# Altium schematic sheet Power_Selection_Archived.SchDoc
size A4
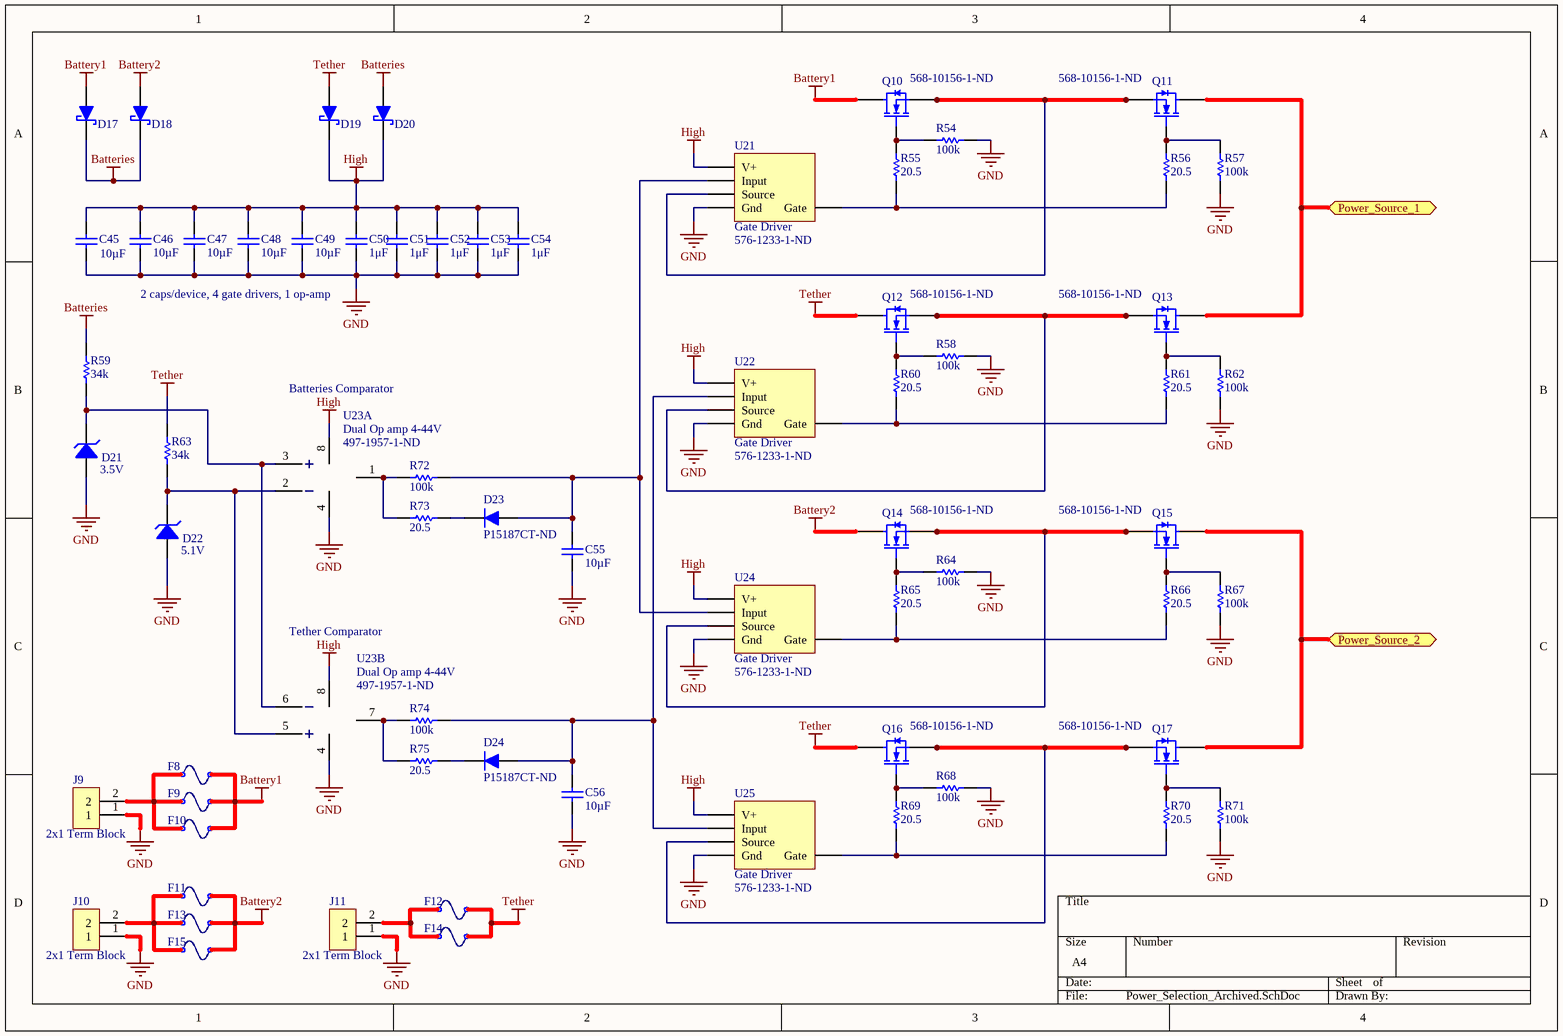
[diagram p0: Power_Selection_Archived.SchDoc]

## Parts
C45  10µF  [CAPC3216N(1206")]
C46  10µF  [CAPC3216N(1206")]
C47  10µF  [CAPC3216N(1206")]
C48  10µF  [CAPC3216N(1206")]
C49  10µF  [CAPC3216N(1206")]
C50  1μF  [CAPC1608N(0603")]
C51  1μF  [CAPC1608N(0603")]
C52  1μF  [CAPC1608N(0603")]
C53  1μF  [CAPC1608N(0603")]
C54  1μF  [CAPC1608N(0603")]
C55  10µF  [CAPC3216N(1206")]
C56  10µF  [CAPC3216N(1206")]
D17  CUS08F30H3FCT-ND  [SC-76]  (value not drawn)
D18  CUS08F30H3FCT-ND  [SC-76]  (value not drawn)
D19  CUS08F30H3FCT-ND  [SC-76]  (value not drawn)
D20  CUS08F30H3FCT-ND  [SC-76]  (value not drawn)
D21  Voltage - Breakdown (Min): 3.5V  [SODFL160X70-2N]  (hidden comment: UCLAMP3301H.TCT)
D22  Voltage - Zener (Nom) (Vz): 5.1V  (hidden comment: MM3Z5V1ST1G)
D23  Supplier Part Number 1: P15187CT-ND  [SODFL535X110-2N]  (hidden comment: DA2S10400L, SOD323F / SC-90)  (no BOM)
D24  Supplier Part Number 1: P15187CT-ND  [SODFL535X110-2N]  (hidden comment: DA2S10400L, SOD323F / SC-90)  (no BOM)
F8  MINI  [MINI BLADE FUSEHOLDER]  (value not drawn)
F9  MINI  [MINI BLADE FUSEHOLDER]  (value not drawn)
F10  MINI  [MINI BLADE FUSEHOLDER]  (value not drawn)
F11  MINI  [MINI BLADE FUSEHOLDER]  (value not drawn)
F12  MINI  [MINI BLADE FUSEHOLDER]  (value not drawn)
F13  MINI  [MINI BLADE FUSEHOLDER]  (value not drawn)
F14  MINI  [MINI BLADE FUSEHOLDER]  (value not drawn)
F15  MINI  [MINI BLADE FUSEHOLDER]  (value not drawn)
J9  2x1 Term Block  [2x1 Terminal Blocks EM2929]
J10  2x1 Term Block  [2x1 Terminal Blocks EM2929]
J11  2x1 Term Block  [2x1 Terminal Blocks EM2929]
Q10  Supplier Part Number 1: 568-10156-1-ND  [LFPAK-PowerSO8]  (hidden comment: MOSFET N-Channel, 40V, 100A, 272W)
Q11  Supplier Part Number 1: 568-10156-1-ND  [LFPAK-PowerSO8]  (hidden comment: MOSFET N-Channel, 40V, 100A, 272W)
Q12  Supplier Part Number 1: 568-10156-1-ND  [LFPAK-PowerSO8]  (hidden comment: MOSFET N-Channel, 40V, 100A, 272W)
Q13  Supplier Part Number 1: 568-10156-1-ND  [LFPAK-PowerSO8]  (hidden comment: MOSFET N-Channel, 40V, 100A, 272W)
Q14  Supplier Part Number 1: 568-10156-1-ND  [LFPAK-PowerSO8]  (hidden comment: MOSFET N-Channel, 40V, 100A, 272W)
Q15  Supplier Part Number 1: 568-10156-1-ND  [LFPAK-PowerSO8]  (hidden comment: MOSFET N-Channel, 40V, 100A, 272W)
Q16  Supplier Part Number 1: 568-10156-1-ND  [LFPAK-PowerSO8]  (hidden comment: MOSFET N-Channel, 40V, 100A, 272W)
Q17  Supplier Part Number 1: 568-10156-1-ND  [LFPAK-PowerSO8]  (hidden comment: MOSFET N-Channel, 40V, 100A, 272W)
R54  100k  [RESC2012N(0805")]
R55  20.5  [RESC1608N(0603")]
R56  20.5  [RESC1608N(0603")]
R57  100k  [RESC2012N(0805")]
R58  100k  [RESC2012N(0805")]
R59  34k  [RESC1608N(0603")]
R60  20.5  [RESC1608N(0603")]
R61  20.5  [RESC1608N(0603")]
R62  100k  [RESC2012N(0805")]
R63  34k  [RESC1608N(0603")]
R64  100k  [RESC2012N(0805")]
R65  20.5  [RESC1608N(0603")]
R66  20.5  [RESC1608N(0603")]
R67  100k  [RESC2012N(0805")]
R68  100k  [RESC2012N(0805")]
R69  20.5  [RESC1608N(0603")]
R70  20.5  [RESC1608N(0603")]
R71  100k  [RESC2012N(0805")]
R72  100k  [RESC2012N(0805")]
R73  20.5  [RESC1608N(0603")]
R74  100k  [RESC2012N(0805")]
R75  20.5  [RESC1608N(0603")]
U21  Gate Driver  Supplier Part Number 1: 576-1233-1-ND  [SOC 8]
U22  Gate Driver  Supplier Part Number 1: 576-1233-1-ND  [SOC 8]
U23  Dual Op amp 4-44V  Supplier Part Number 2: 497-1957-1-ND  [SOC-8]  (parts A,B of 2)
U24  Gate Driver  Supplier Part Number 1: 576-1233-1-ND  [SOC 8]
U25  Gate Driver  Supplier Part Number 1: 576-1233-1-ND  [SOC 8]

## Ports
Power_Source_1, Power_Source_2

## Nets
Batteries: D17.K(Cathode) D18.K(Cathode) D20.A(Anode) R59.2
Battery1: D17.A(Anode) F8.2 F9.2 F10.2 Q10.5(Drain)
Battery2: D18.A(Anode) F11.2 F13.2 F15.2 Q14.5(Drain)
GND: C45.1(Anode) C46.1(Anode) C47.1(Anode) C48.1(Anode) C49.1(Anode) C50.1(Anode) C51.1(Anode) C52.1(Anode) C53.1(Anode) C54.1(Anode) C55.1(Anode) C56.1(Anode) D21.1(Anode) D22.1(Anode) J9.1 J10.1 J11.1 R54.1 R57.2 R58.1 R62.2 R64.1 R67.2 R68.1 R71.2 U21.4(Gnd) U22.4(Gnd) U23.4(Vcc-) U24.4(Gnd) U25.4(Gnd)
High: C45.2(Cathode) C46.2(Cathode) C47.2(Cathode) C48.2(Cathode) C49.2(Cathode) C50.2(Cathode) C51.2(Cathode) C52.2(Cathode) C53.2(Cathode) C54.2(Cathode) D19.K(Cathode) D20.K(Cathode) U21.1(V+) U22.1(V+) U23.8(Vcc_+) U24.1(V+) U25.1(V+)
Tether: D19.A(Anode) F12.2 F14.2 Q12.5(Drain) Q16.5(Drain) R63.2
Power_Source_1: Q11.5(Drain) Q13.5(Drain) ; port Power_Source_1
Power_Source_2: Q15.5(Drain) Q17.5(Drain) ; port Power_Source_2
NetC55_2: C55.2(Cathode) D23.1(Anode) R72.2 U21.2(Input) U24.2(Input)
NetC56_2: C56.2(Cathode) D24.1(Anode) R74.2 U22.2(Input) U25.2(Input)
NetD21_2: D21.2(Cathode) R59.1 U23.3(V+) U23.6(V-)
NetD22_2: D22.2(Cathode) R63.1 U23.2(V-) U23.5(V+)
NetD23_2: D23.2(Cathode) R73.2
NetD24_2: D24.2(Cathode) R75.2
NetF8_1: F8.1 F9.1 F10.1 J9.2
NetF11_1: F11.1 F13.1 F15.1 J10.2
NetF12_1: F12.1 F14.1 J11.2
NetQ10_1: Q10.1(Source) Q10.2(Source) Q10.3(Source) Q11.1(Source) Q11.2(Source) Q11.3(Source) U21.3(Source)
NetQ10_4: Q10.4(Gate) R54.2 R55.2
NetQ11_4: Q11.4(Gate) R56.2 R57.1
NetQ12_1: Q12.1(Source) Q12.2(Source) Q12.3(Source) Q13.1(Source) Q13.2(Source) Q13.3(Source) U22.3(Source)
NetQ12_4: Q12.4(Gate) R58.2 R60.2
NetQ13_4: Q13.4(Gate) R61.2 R62.1
NetQ14_1: Q14.1(Source) Q14.2(Source) Q14.3(Source) Q15.1(Source) Q15.2(Source) Q15.3(Source) U24.3(Source)
NetQ14_4: Q14.4(Gate) R64.2 R65.2
NetQ15_4: Q15.4(Gate) R66.2 R67.1
NetQ16_1: Q16.1(Source) Q16.2(Source) Q16.3(Source) Q17.1(Source) Q17.2(Source) Q17.3(Source) U25.3(Source)
NetQ16_4: Q16.4(Gate) R68.2 R69.2
NetQ17_4: Q17.4(Gate) R70.2 R71.1
NetR55_1: R55.1 R56.1 U21.5(Gate)
NetR60_1: R60.1 R61.1 U22.5(Gate)
NetR65_1: R65.1 R66.1 U24.5(Gate)
NetR69_1: R69.1 R70.1 U25.5(Gate)
NetR72_1: R72.1 R73.1 U23.1(Out)
NetR74_1: R74.1 R75.1 U23.7(Out)

## Notes on the sheet
- 2 caps/device, 4 gate drivers, 1 op-amp
- Batteries Comparator
- Tether Comparator

## Library data of the parts
C45-C49 C55 C56 = 10uF 50V 1206 SMD, Ceramic: Capacitor, Ceramic, 50V, +/- 10%, 1206 SMD, X5R; Published: 14-06-01; Publisher: AUVic; PackageDescription: Chip Capacitor; Value: 10µF; Supplier 1: Digi-Key; Supplier Part Number 1: 1276-2876-1-ND
C50-C54 = 1uF 50V 0603 SMD, Ceramic: Capacitor, Ceramic, 50V, +/- 10%, 0603 SMD, X5R; PackageDescription: Chip Capacitor; Value: 1μF; Created By: Lyden Smith; Date Created: 2017-10-26; Supplier 1: Digi-Key; Supplier Part Number 1: 1276-1860-6-ND
D17-D20 = CUS08F30H3FCT-ND: Diode, Schottky, 30V, 800mA; Created By: Andy Bates; Publisher: AUVic; Date Created: 2016-09-09; Supplier 1: Digi-Key; Supplier Part Number 1: CUS08F30H3FCT-ND
D21 = UCLAMP3301H.TCT: Diode, TVS, 3.5V; Manufacturer: Semtech Corporation; Type: Zener; Unidirectional Channels: 1; Voltage - Reverse Standoff (Typ): 3.3V; Voltage - Clamping (Max) @ Ipp: 8V; Power - Peak Pulse: 40W; RoHS: RoHS Compliant; Supplier 1: Digi-Key; Supplier Part Number 1: UCLAMP3301HCT-ND
D22 = MM3Z5V1ST1G: DIODE ZENER 5.1V 200MW SOD323; Manufacturer: ON Semiconductor; Tolerance: ±2%; Impedance (Max) (Zzt): 60 Ohm; Current - Reverse Leakage @ Vr: 2µA @ 2V; Voltage - Forward (Vf) (Max) @ If: 900mV @ 10mA; Supplier 1: Digi-Key; Manufacturer Part Number: MM3Z5V1ST1G; RoHS: RoHS Compliant; Category: Discrete Semiconductor Products; Stock 1: 60540; Pricing 1: 1=0.15, 10=0.137, 25=0.1248, 100=0.0899, 250=0.05296, 500=0.04394, 1000=0.02997 (USD); Packaging: Cut Tape (CT); Power - Max: 200mW; Operating Temperature: -65°C ~ 150°C; Mounting Type: Surface Mount; Package / Case: SC-76, SOD-323; Supplier Device Package: SOD-323; ComponentLink1URL: http://www.onsemi.com/pub_link/Collateral/MM3Z2V4ST1-D.PDF; ComponentLink1Description: http://www.onsemi.com/pub_link/Collateral/MM3Z2V4ST1-D.PDF; Supplier Part Number 1: MM3Z5V1ST1GOSCT-ND
D23 D24 = DA2S10400L, SOD323F / SC-90: Forward Voltage Drop: 1.1V; Created By: Andy Bates; Publisher: AUVic; Date Created: 2016-09-08; Supplier 1: Digi-Key
F8-F15 = MINI, ATC, ATO, etc. Blade Fuse: Blade Fuse Holder, 30A; Created By: Lyden Smith; Date Created: 2018-01-11; Supplier 1: Digi-Key; Supplier Part Number 1: 36-3557-2-ND; Type: MINI
J9-J11 = 2x1 Terminal Block, 65A, 6-20AWG: Made by: Lyden Smith; Supplier 1: Digi-Key; Supplier Part Number 1: 283-4339-ND; Date Made: 2017-11-13
Q10-Q17 = MOSFET N-Channel, 40V, 100A, 272W: MOSFET N-Channel, 40V, 100A, 272W, Enh-Mode; MFG: NXP Semiconductors; MFG#: PSMN1R8-40YLC,115; Reviewed_By: Ashwin Sira; Latest_Revision_Note: Attached footprint; Created By: Ashwin Sira; Publisher: AUVic; Reviewed_Date: 2016_04_26; Latest_Revision_By: Ashwin Sira; Latest_Revision_Date: 2016_04_26; Supplier 1: Digi-Key
R54 R57 R58 R62 R64 R67 R68 R71 R72 R74 = 100kR, 1%, 1/4W, 0805 SMD: Made By: Ashwin Sira; Owned By: AUVic; Created On: 14-05-31; Last Edited: 14-05-31; Value: 100k; Supplier 1: Digi-Key; Supplier Part Number 1: 311-1.00MCRCT-ND
R55 R56 R60 R61 R65 R66 R69 R70 R73 R75 = 20.5 Ohm, 1%, 1/10W , 0603, SMD: Created By: Gabriel Green; Publisher: AUVic; Date Created: 2017-06-23; Value: 20.5; Supplier 1: Digi-Key; Supplier Part Number 1: P20.5HCT-ND
R59 R63 = 34kR, 1%, 1/10W, 0603: RES 34K OHM 1/10W 1% 0603 SMD; Manufacturer: Yageo; Manufacturer Part Number: RC0603FR-0734KL; Power (Watts): 0.1W, 1/10W; Temperature Coefficient: ±100ppm/°C; Supplier 1: Digi-Key; RoHS: RoHS Compliant; Category: Resistors; Stock 1: 192; Pricing 1: 1=0.1, 10=0.015, 25=0.0108, 100=0.006, 250=0.00456, 500=0.00364, 1000=0.00268, 2500=0.00233 (USD); Packaging: Cut Tape (CT); Resistance: 34k; Tolerance: ±1%; Composition: Thick Film; Features: Moisture Resistant; Operating Temperature: -55°C ~ 155°C; Package / Case: 0603 (1608 Metric); Supplier Device Package: 0603; Size / Dimension: 0.063" L x 0.031" W (1.60mm x 0.80mm); Height: 0.022" (0.55mm); Number of Terminations: 2; ComponentLink1URL: http://www.yageo.com/documents/recent/PYu-RC0603_51_RoHS_L_4.pdf; ComponentLink1Description: http://www.yageo.com/documents/recent/PYu-RC0603_51_RoHS_L_4.pdf; Supplier Part Number 1: 311-34.0KHRCT-ND
U21 U22 U24 U25 = Gate Driver TTL Logic 3 - 30V: Supplier 1: Digi-Key
U23 = Dual Op amp 4-44V: MC33172; Made by: Andy Bates; Created on: 06/10/2016; Supplier 1: Digikey; Supplier 1 Part Number: 497-1957-1-ND; Supplier 2: Digi-Key